# EAGLE design AVR_ISP (EAGLE 9.6.2)
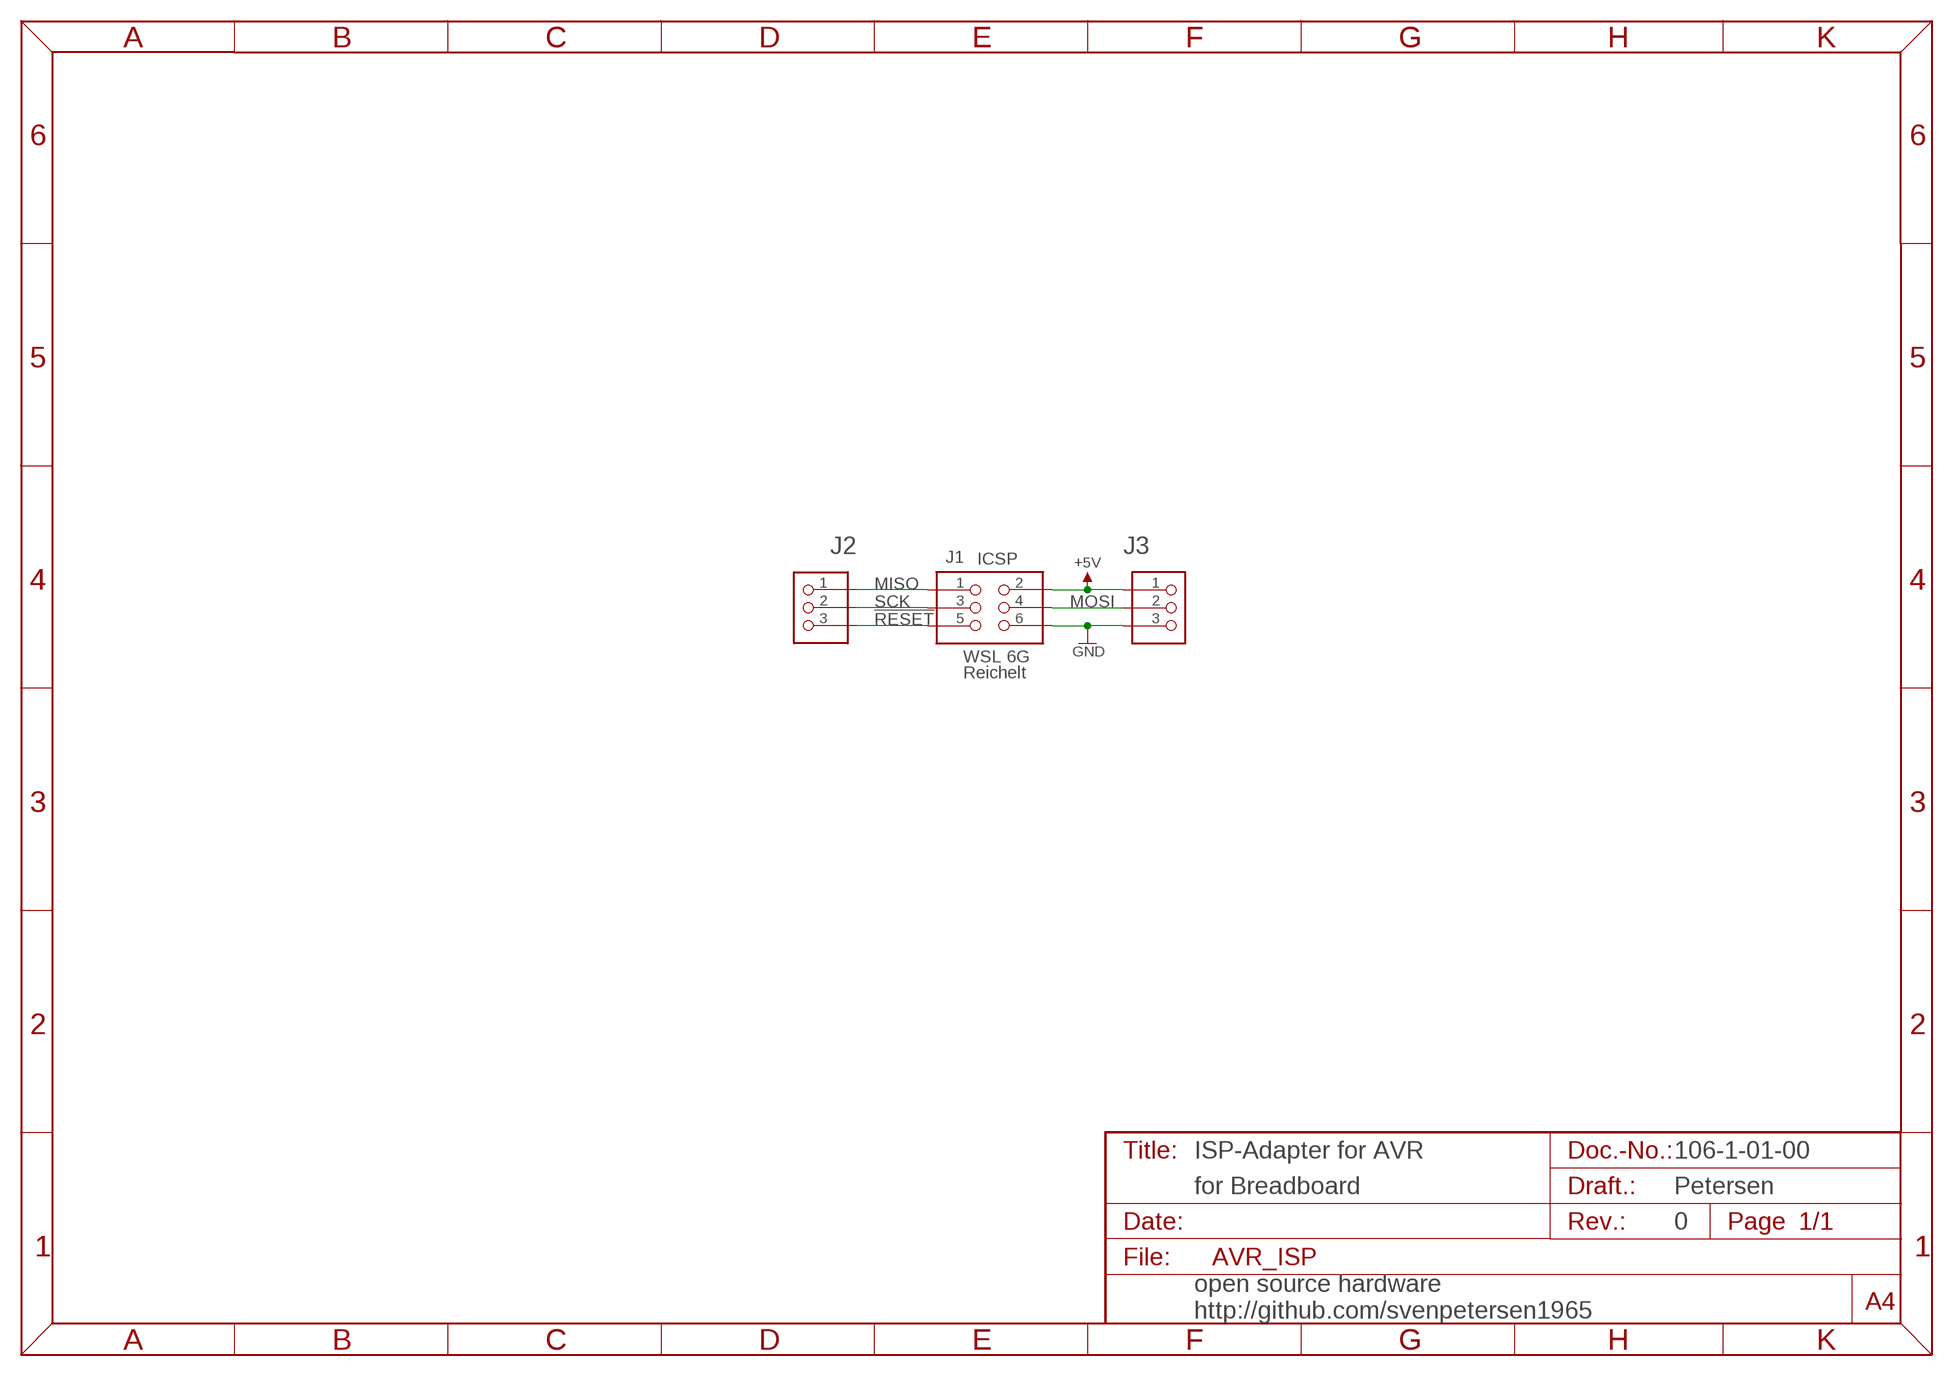
[diagram p0: schematic, sheet 1]

## Parts
J1  WSL 6G  2X03WV  [2X03WV]
J2  PINHD-1X3  [1X03]
J3  PINHD-1X3  [1X03]

## Nets
!RESET: J1.5 J2.3
+5V: J1.2 J3.1
GND: J1.6 J3.3
MISO: J1.1 J2.1
MOSI: J1.4 J3.2
SCK: J1.3 J2.2

## Notes on the sheet
- ICSP
- Reichelt
- ISP-Adapter for AVR | 106-1-01-00
- for Breadboard | Petersen
- 0
- open source hardware
- http://github.com/svenpetersen1965

## Library data of the parts
J1 = PINHEAD:2X03WV; DIST: Reichelt: WSL 6G
J2 J3 = PINHEAD:PINHD-1X3

## Board
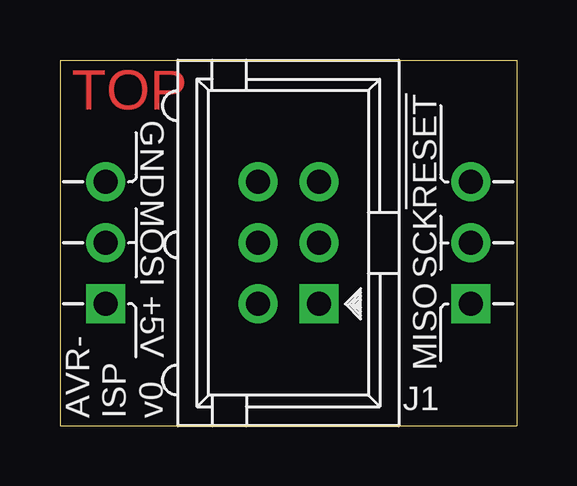
[diagram p1: board, top side]
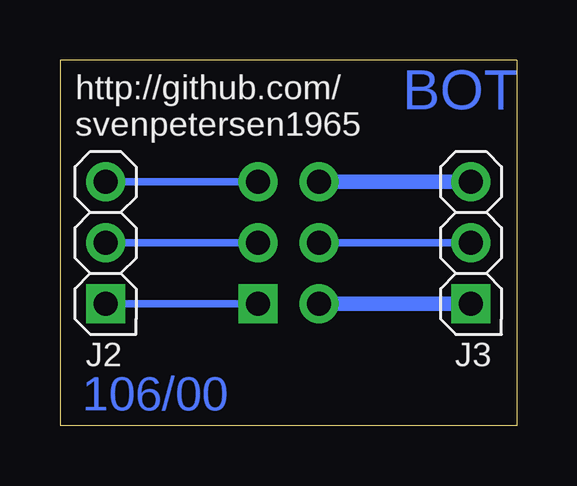
[diagram p2: board, bottom side, seen from below]

Size 19.05 x 15.24 mm. Coordinates in mm from the lower left corner, seen from the top.
Outline: 0,0 19.05,0 19.05,15.24 0,15.24 0,0
Copper layers (1*16): Top 0.035mm / dielectric 1.5mm / Bottom 0.035mm
Design rules "default": minimum track width 6mil, minimum drill 0.35mm, track to track 6mil, track to pad 6mil, pad to pad 6mil, via to via 6mil, smd to smd 6mil, copper to edge 40mil, drill to drill 6mil, minimum pad ring 10mil, minimum via ring 8mil, stop-mask expansion 4mil, vias tented up to drill 0mil, thermal gap 10mil

### Footprints (pad centres in the part's own frame; a part is rotated, then mirrored left to right if it is on the bottom)
2X03WV = drill 1 pad 1.626 square: 1 -2.54,-1.27 | drill 1 pad 1.626: 2 -2.54,1.27; 3 0,-1.27; 4 0,1.27; 5 2.54,-1.27; 6 2.54,1.27
1X03 = drill 1 pad 1.626 square: 1 -2.54,0 | drill 1 pad 1.626: 2 0,0; 3 2.54,0

### Placement (x,y rotation side)
J1  9.53,7.62 90 top
J2  17.14,7.62 90 bottom
J3  1.91,7.62 90 bottom
U$2  [PCB-TITLE/]  -0.16,22.86 0 top  (outside the outline)
U$5  [2LAYER]  0.48,13.18 0 top

### Tracks (layer width: path | path; a pad name or v marks a point on that pad's centre or on a via)
!RESET
  Bottom 0.305: J1.5 J2.3
+5V
  Bottom 0.61: J1.2 J3.1
GND
  Bottom 0.61: J1.6 J3.3
MISO
  Bottom 0.305: J1.1 J2.1
MOSI
  Bottom 0.305: J1.4 J3.2
SCK
  Bottom 0.305: J1.3 J2.2

### Text on the board
Bottom: 106/00
tPlace: GND | !RESET | MOSI | SCK | +5V | MISO | AVR- / ISP / v0
bPlace: http://github.com/ / svenpetersen1965
Document: Sven Petersen | 106-2-01-00 | 2018 | 35µm | 2 | 0